# Altium schematic sheet 5-SD-Card.SchDoc: Thermocouple Temperature Logger
size A4; Date: 14.03.2026; Author: MG & JK; Revision: 1-0; SheetNumber: 5; SheetTotal: 7; Model: Rev 1.0; PageSetup: Record=PageOptions|CenterHorizontal=True|CenterVertical=True|PrintScale=0.52|XCorrection=1.00|YCorrection=1.00|PrintKind=1|BorderSize=5000000|LeftOffset=0|BottomOffset=0|Orientation=2|PaperLength=4200|PaperWidth=2970|Scale=100|PaperSource=7|PrintQuality=600|MediaType=1|DitherType=10|PaperKind=A3|PrintScaleMode=1
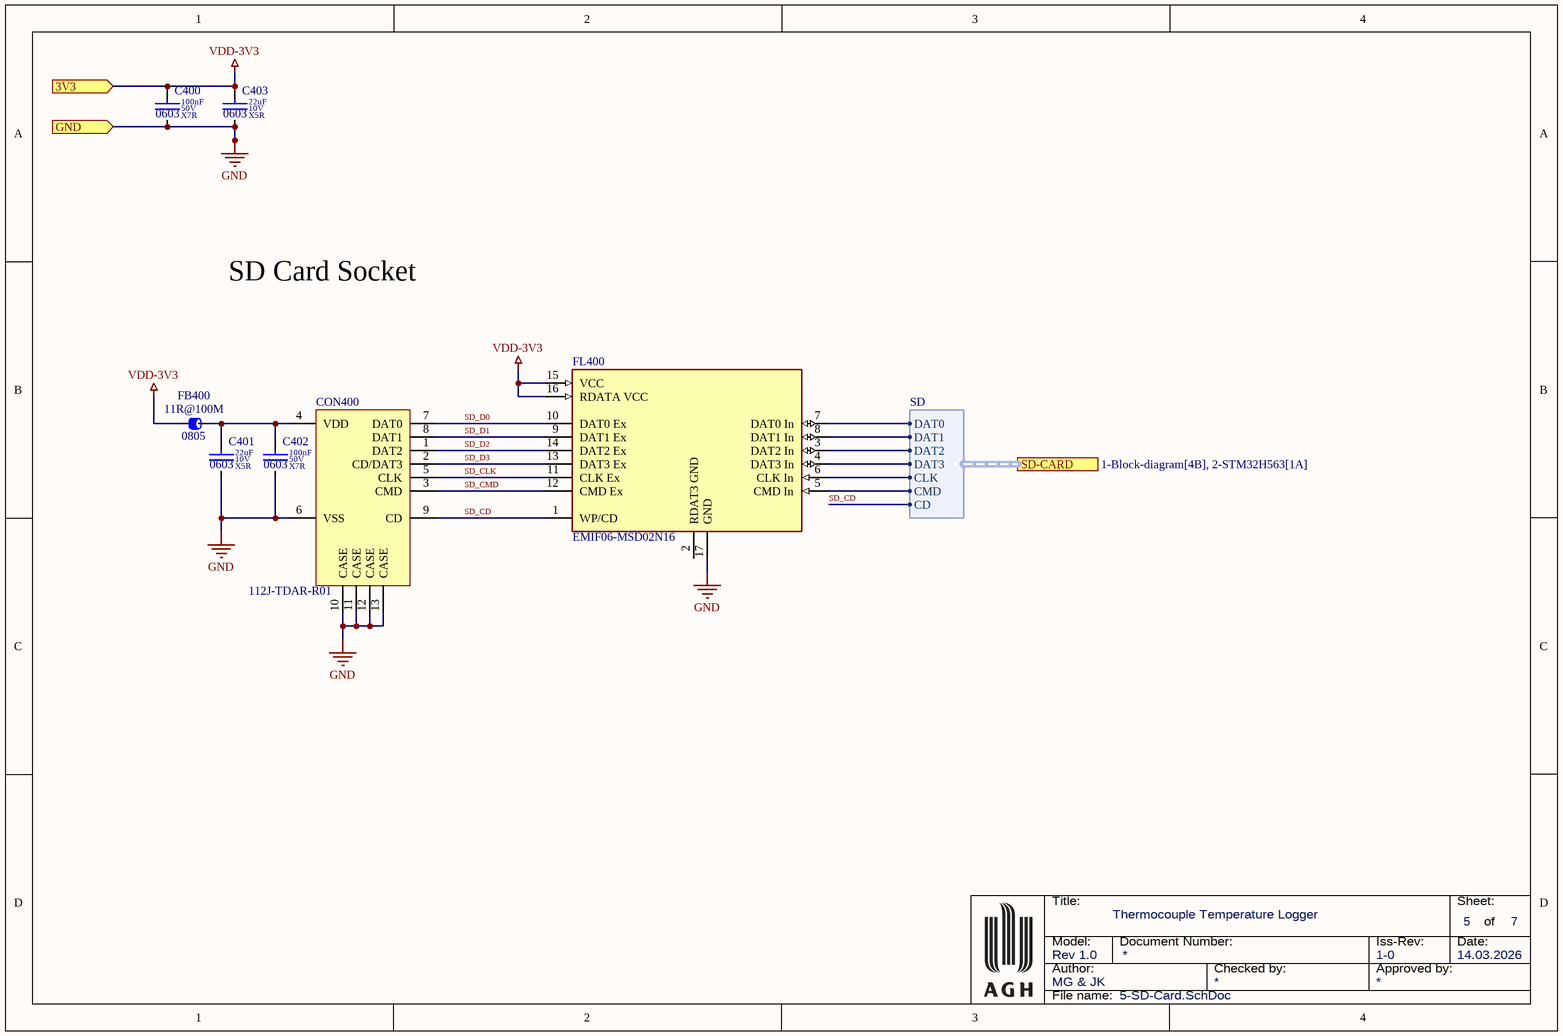
[diagram p0: 5-SD-Card.SchDoc]

## Parts
C400  value 100nF  Dielectric: X7R  Voltage: 50V  SCH_Footprint: 0603  [C_0603_1608]  (hidden comment: Ceramic X7R)
C401  value 22uF  Dielectric: X5R  Voltage: 10V  SCH_Footprint: 0603  [C_0603_1608]  (hidden comment: Ceramic X5R)
C402  value 100nF  Dielectric: X7R  Voltage: 50V  SCH_Footprint: 0603  [C_0603_1608]  (hidden comment: Ceramic X7R)
C403  value 22uF  Dielectric: X5R  Voltage: 10V  SCH_Footprint: 0603  [C_0603_1608]  (hidden comment: Ceramic X5R)
CON400  112J-TDAR-R01  [112J-TDAR-R01]
FB400  value 11R@100M  SCH_Footprint: 0805  [FB_0805_2012]  (hidden comment: Ferrite bead)
FL400  EMIF06-MSD02N16  [FP-EMIF06-MSD02N16-MFG]

## Ports
3V3 (in, see 1-Block-diagram[4B], 2-STM32H563[2A], 3-Power-Supply[2D], 4-Ethernet[1A], 6-Connectors[1A]), GND (in, see 1-Block-diagram[4B], 2-STM32H563[2A], 3-Power-Supply[3A], 4-Ethernet[1A], 6-Connectors[1A], 7-LTC2983[1A]), SD-CARD (harness SD, see 1-Block-diagram[4B], 2-STM32H563[1A])

## Harnesses
SD: DAT0, DAT1, DAT2, DAT3, CLK, CMD, CD

## Nets
GND: C400.2 C401.2 C402.2 C403.2 CON400.6(VSS) CON400.10(CASE) CON400.11(CASE) CON400.12(CASE) CON400.13(CASE) FL400.17(GND) ; port GND
VDD-3V3: C400.1 C403.1 FB400.1 FL400.15(VCC) FL400.16(RDATA_VCC) ; port 3V3
SD_CD: CON400.9(CD) FL400.1(WP/CD) ; port SD-CARD.CD
SD_CLK: CON400.5(CLK) FL400.11(CLK_Ex)
SD_CMD: CON400.3(CMD) FL400.12(CMD_Ex)
SD_D0: CON400.7(DAT0) FL400.10(DAT0_Ex)
SD_D1: CON400.8(DAT1) FL400.9(DAT1_Ex)
SD_D2: CON400.1(DAT2) FL400.14(DAT2_Ex)
SD_D3: CON400.2(CD/DAT3) FL400.13(DAT3_Ex)
NetC401_1: C401.1 C402.1 CON400.4(VDD) FB400.2
NetFL400_3: FL400.3(DAT2_In) ; port SD-CARD.DAT2
NetFL400_4: FL400.4(DAT3_In) ; port SD-CARD.DAT3
NetFL400_5: FL400.5(CMD_In) ; port SD-CARD.CMD
NetFL400_6: FL400.6(CLK_In) ; port SD-CARD.CLK
NetFL400_7: FL400.7(DAT0_In) ; port SD-CARD.DAT0
NetFL400_8: FL400.8(DAT1_In) ; port SD-CARD.DAT1

Not connected (* = marked no-connect by the designer): FL400 2(RDAT3_GND)

## Notes on the sheet
- SD Card Socket
- Title:
- Sheet:
- of
- Author:
- Model:
- Document Number:
- Checked by:
- Iss-Rev:
- Approved by:
- Date:
- File name:

## Library data of the parts
C400 C402 = C_100nF_50V_X7R_0603_10_AECQ1: Capacitor; Manufacturer: Murata; Manufacturer Part Number: GCM188R71H104KA57D; Tolerance (%): 10; AEC-Q: 1; Part Number: C_100nF_50V_X7R_0603_10_AECQ1; HelpURL: https://www.murata.com/products/productdetail?partno=GCM188R71H104KA57%23; Supplier 1: TME; Supplier Part Number 1: GCM188R71H104KA57D; Supplier 2: RS Components; Supplier 3: Farnell; Supplier Part Number 3: 4360223; Supplier 4: Mouser; Supplier Part Number 4: 81-GCM188R71H104KA7D; Supplier 5: Digi-Key; Supplier Part Number 5: 490-4779-1-ND; Supplier 6: LCSC; Supplier Part Number 6: C85864
C401 C403 = C_22uF_10V_X5R_0603_20: Capacitor; Manufacturer: Murata; Manufacturer Part Number: GRM188R61A226ME15D; Tolerance (%): 20; Part Number: C_22uF_10V_X5R_0603_20; HelpURL: https://www.mouser.pl/datasheet/2/281/1/GRM188R61A226ME15_02A-1985787.pdf; Supplier 1: TME; Supplier Part Number 1: GRM188R61A226ME15D; Supplier 2: RS Components; Supplier 3: Farnell; Supplier Part Number 3: 2426957; Supplier 4: Mouser; Supplier Part Number 4: 81-GRM188R61A226ME5D; Supplier 5: Digi-Key; Supplier Part Number 5: 490-10476-1-ND; Supplier 6: LCSC
FB400 = FB_2508051107Y0: Manufacturer: Fair-Rite; Current: 300mA; Resistance: 100mR; Part Number: FB_2508051107Y0; HelpURL: https://datasheet.octopart.com/2508051107Y0-Fair-Rite-datasheet-834.pdf; Manufacturer Part Number: 2508051107Y0; Supplier 1: TME; Supplier 2: RS Components; Supplier 3: Farnell; Supplier Part Number 3: 1612004; Supplier 4: Mouser; Supplier Part Number 4: 623-2508051107Y0; Supplier 5: Digi-Key; Supplier Part Number 5: 1934-1397-1-ND; Supplier 6: LCSC
FL400 = CMP-12221-000004-1: FILTER RC(PI) 45 OHM/20PF SMD; Max Breakdown Voltage: 8V; Number of Channels: 6; Capacitance: 20pF; ESD Protection: Yes; Min Operating Temperature: -30°C; Contact Plating: Gold; Width: 0.047inch; Package Quantity: 1; Length: 3.55mm; Mount: Surface Mount; Breakdown Voltage: 8V; Max Operating Temperature: 85°C; REACH SVHC: No SVHC; Radiation Hardening: No; Depth: 1.25mm; Number of Pins: 16; Height: 0.022inch; Termination: Flat; Packaging: Tape and Reel; Case/Package: QFN; Lead Free: Lead Free